# EAGLE design 4bit_CPU (EAGLE 7.1.0)
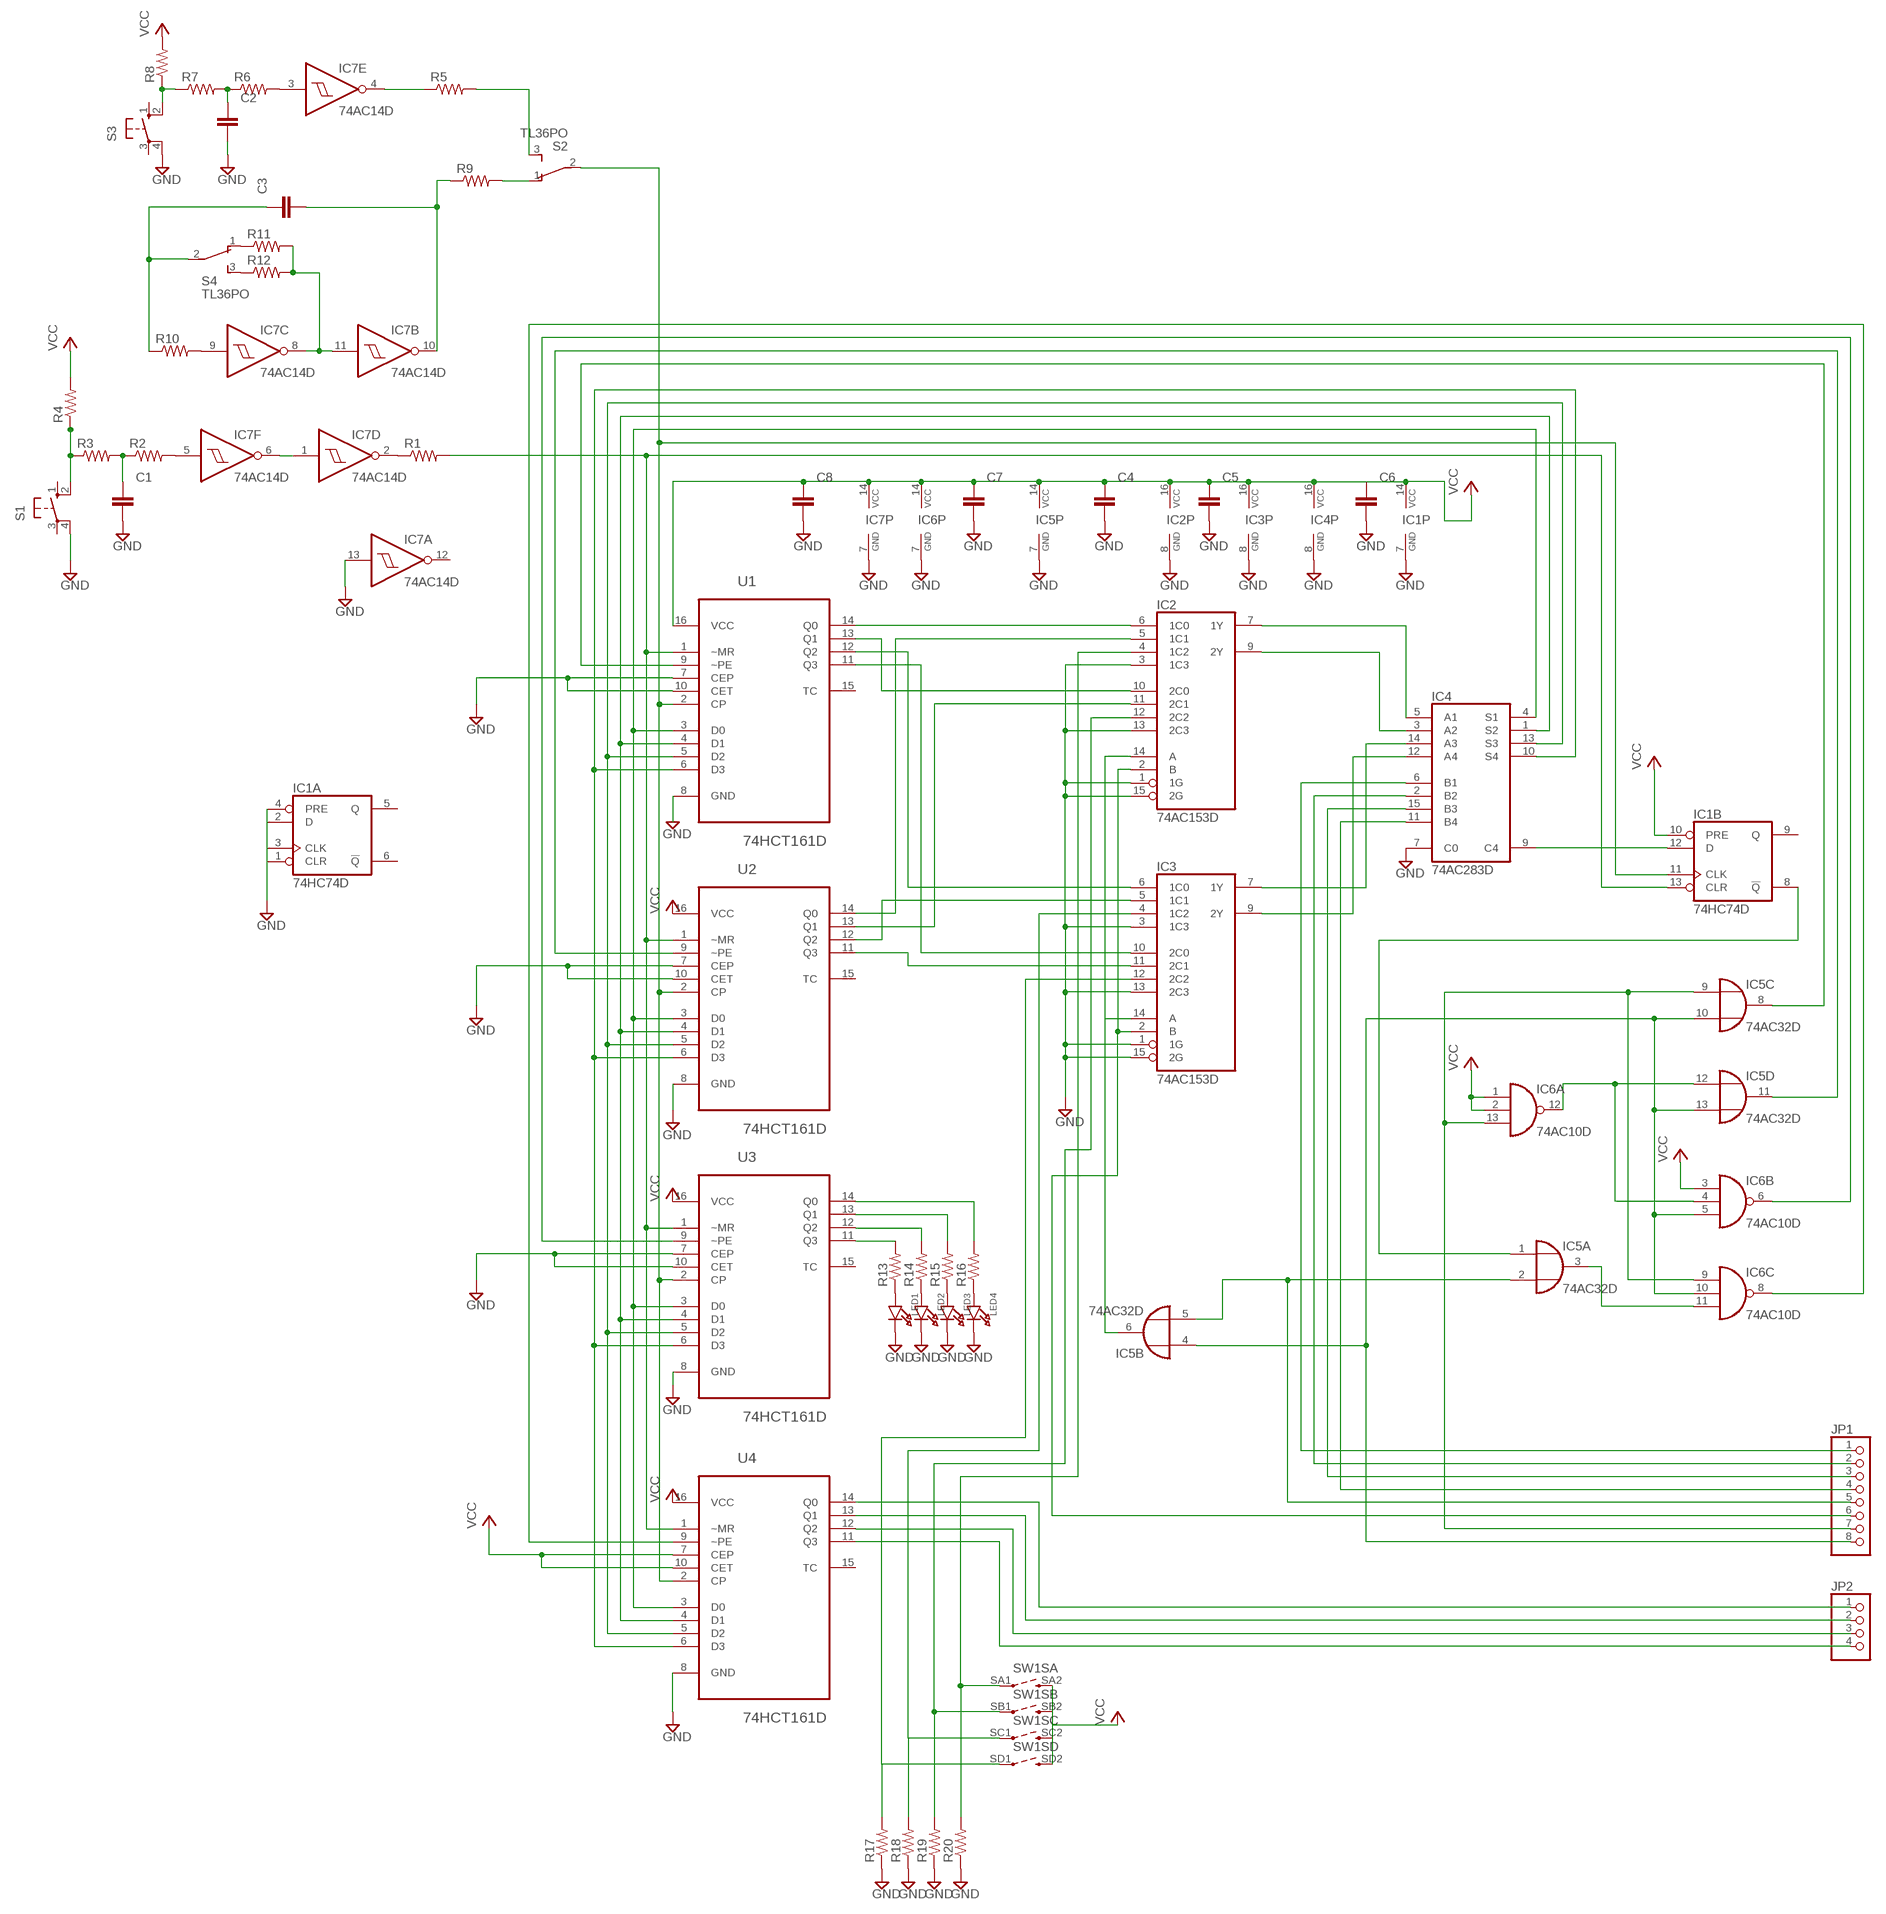
[diagram p0: schematic, sheet 1]

## Parts
C1  CAPACITOR_NPOL-0603  [C603]
C2  CAPACITOR_NPOL-0603  [C603]
C3  CAPACITOR_NPOL-0603  [C603]
C4  CAPACITOR_NPOL-0603  [C603]
C5  CAPACITOR_NPOL-0603  [C603]
C6  CAPACITOR_NPOL-0603  [C603]
C7  CAPACITOR_NPOL-0603  [C603]
C8  CAPACITOR_NPOL-0603  [C603]
IC1  74HC74D  [SO14]
IC2  74AC153D  [SO16]
IC3  74AC153D  [SO16]
IC4  74AC283D  [SO16]
IC5  74AC32D  [SO14]
IC6  74AC10D  [SO14]
IC7  74AC14D  [SO14]
JP1  HEADER-1X8  [1X08_OVAL]
JP2  HEADER-1X4  [1X04_OVAL]
LED1  LED0603  [CHIPLED_0603]
LED2  LED0603  [CHIPLED_0603]
LED3  LED0603  [CHIPLED_0603]
LED4  LED0603  [CHIPLED_0603]
R1  R-US_R0603  [R0603]
R2  R-US_R0603  [R0603]
R3  R-US_R0603  [R0603]
R4  R-US_R0603  [R0603]
R5  R-US_R0603  [R0603]
R6  R-US_R0603  [R0603]
R7  R-US_R0603  [R0603]
R8  R-US_R0603  [R0603]
R9  R-US_R0603  [R0603]
R10  R-US_R0603  [R0603]
R11  R-US_R0603  [R0603]
R12  R-US_R0603  [R0603]
R13  R-US_R0603  [R0603]
R14  R-US_R0603  [R0603]
R15  R-US_R0603  [R0603]
R16  R-US_R0603  [R0603]
R17  R-US_R0603  [R0603]
R18  R-US_R0603  [R0603]
R19  R-US_R0603  [R0603]
R20  R-US_R0603  [R0603]
S1  10-XX  [B3F-10XX]
S2  TL36PO  [TL3XPO]
S3  10-XX  [B3F-10XX]
S4  TL36PO  [TL3XPO]
SW1  SW_DIP_4P  [SW-SMT-4]
U1  74HCT161D  [SOIC127P600X175-16N]
U2  74HCT161D  [SOIC127P600X175-16N]
U3  74HCT161D  [SOIC127P600X175-16N]
U4  74HCT161D  [SOIC127P600X175-16N]

## Nets
GND: C1.2 C2.2 C4.2 C5.2 C6.2 C7.2 C8.2 IC1.1(A:CLR) IC1.2(A:D) IC1.3(A:CLK) IC1.4(A:PRE) IC1.7(P:GND) IC2.1(1G) IC2.3(1C3) IC2.8(GND) IC2.13(2C3) IC2.15(2G) IC3.1(1G) IC3.3(1C3) IC3.8(GND) IC3.13(2C3) IC3.15(2G) IC4.7(C0) IC4.8(GND) IC5.7(P:GND) IC6.7(P:GND) IC7.7(P:GND) IC7.13(A:I) LED1.C LED2.C LED3.C LED4.C R17.1 R18.1 R19.1 R20.1 S1.4(P1) S3.4(P1) U1.7(CEP) U1.10(CET) U2.7(CEP) U2.8(GND) U2.10(CET) U3.7(CEP) U3.8(GND) U3.10(CET) U4.8(GND)
N$1: IC2.14(A) IC3.14(A) IC5.6(B:O)
N$2: IC2.2(B) IC3.2(B) JP1.6
N$3: IC2.6(1C0) U1.14(Q0)
N$4: IC2.5(1C1) U2.14(Q0)
N$5: IC2.10(2C0) U1.13(Q1)
N$6: IC3.6(1C0) U1.12(Q2)
N$7: IC3.5(1C1) U2.12(Q2)
N$8: IC3.10(2C0) U1.11(Q3)
N$9: IC3.11(2C1) U2.11(Q3)
N$10: IC2.11(2C1) U2.13(Q1)
N$11: IC2.7(1Y) IC4.5(A1)
N$12: IC2.9(2Y) IC4.3(A2)
N$13: IC3.7(1Y) IC4.14(A3)
N$14: IC3.9(2Y) IC4.12(A4)
N$15: JP2.1 U4.14(Q0)
N$16: U1.8(GND)
N$17: IC1.11(B:CLK) S2.2(P) U1.2(CP) U2.2(CP) U3.2(CP) U4.2(CP)
N$18: IC1.12(B:D) IC4.9(C4)
N$19: IC1.13(B:CLR) R1.2 U1.1(~MR) U2.1(~MR) U3.1(~MR) U4.1(~MR)
N$20: IC4.4(S1) U1.3(D0) U2.3(D0) U3.3(D0) U4.3(D0)
N$21: IC4.1(S2) U1.4(D1) U2.4(D1) U3.4(D1) U4.4(D1)
N$22: IC4.13(S3) U1.5(D2) U2.5(D2) U3.5(D2) U4.5(D2)
N$23: IC4.10(S4) U1.6(D3) U2.6(D3) U3.6(D3) U4.6(D3)
N$24: IC5.9(C:I0) IC6.9(C:I0) IC6.13(A:I2) JP1.7
N$25: IC5.4(B:I0) IC5.10(C:I1) IC5.13(D:I1) IC6.5(B:I2) IC6.10(C:I1) JP1.8
N$26: IC5.12(D:I0) IC6.4(B:I1) IC6.12(A:O)
N$27: IC5.3(A:O) IC6.11(C:I2)
N$28: IC1.8(B:!Q) IC5.1(A:I0)
N$29: IC5.2(A:I1) IC5.5(B:I1) JP1.5
N$30: R5.2 S2.3(S)
N$31: IC5.8(C:O) U1.9(~PE)
N$32: IC5.11(D:O) U2.9(~PE)
N$33: IC6.6(B:O) U3.9(~PE)
N$34: IC6.8(C:O) U4.9(~PE)
N$35: IC7.2(D:O) R1.1
N$36: IC7.1(D:I) IC7.6(F:O)
N$37: IC7.5(F:I) R2.2
N$38: C1.1 R2.1 R3.2
N$39: R3.1 R4.1 S1.2(S1)
N$40: IC7.4(E:O) R5.1
N$41: IC7.3(E:I) R6.2
N$42: C2.1 R6.1 R7.2
N$43: R7.1 R8.1 S3.2(S1)
N$44: R9.2 S2.1(O)
N$45: IC7.8(C:O) IC7.11(B:I) R11.2 R12.2
N$46: C3.2 IC7.10(B:O) R9.1
N$47: IC7.9(C:I) R10.2
N$48: JP2.2 U4.13(Q1)
N$49: R11.1 S4.1(O)
N$50: R12.1 S4.3(S)
N$51: C3.1 R10.1 S4.2(P)
N$52: IC4.11(B4) JP1.4
N$53: IC4.15(B3) JP1.3
N$54: IC4.2(B2) JP1.2
N$55: IC4.6(B1) JP1.1
N$56: JP2.3 U4.12(Q2)
N$57: JP2.4 U4.11(Q3)
N$58: R13.2 U3.11(Q3)
N$59: R14.2 U3.12(Q2)
N$60: R15.2 U3.13(Q1)
N$61: R16.2 U3.14(Q0)
N$62: LED1.A R13.1
N$63: LED2.A R14.1
N$64: LED3.A R15.1
N$65: LED4.A R16.1
N$67: IC2.4(1C2) R20.2 SW1.SA1
N$68: IC2.12(2C2) R19.2 SW1.SB1
N$69: IC3.4(1C2) R18.2 SW1.SC1
N$70: IC3.12(2C2) R17.2 SW1.SD1
VCC: C4.1 C5.1 C6.1 C7.1 C8.1 IC1.10(B:PRE) IC1.14(P:VCC) IC2.16(VCC) IC3.16(VCC) IC4.16(VCC) IC5.14(P:VCC) IC6.1(A:I0) IC6.2(A:I1) IC6.3(B:I0) IC6.14(P:VCC) IC7.14(P:VCC) R4.2 R8.2 SW1.SA2 SW1.SB2 SW1.SC2 SW1.SD2 U1.16(VCC) U2.16(VCC) U3.16(VCC) U4.7(CEP) U4.10(CET) U4.16(VCC)
Unconnected: IC1.5(A:Q) IC1.6(A:!Q) IC1.9(B:Q) IC7.12(A:O) S1.1(S) S1.3(P) S3.1(S) S3.3(P) U1.15(TC) U2.15(TC) U3.15(TC) U4.15(TC)

## Library data of the parts
C1-C8 = dp_devices:CAPACITOR_NPOL: Non-Polarized capacitor in various packages
IC1 = 74xx-eu:74*74: Dual D type positive edge triggered FLIP FLOP, preset and clear
IC2 IC3 = 74xx-eu:74*153: Dual 4-line to 1-line data SELECTOR/MULTIPLEXER
IC4 = 74xx-eu:74*283: 4-bit binary FULL ADDER, fast carry
IC5 = 74xx-eu:74*32: Quad 2-input OR gate
IC6 = 74xx-eu:74*10: Triple 3-input NAND gate
IC7 = 74xx-eu:74*14: Hex schmitt trigger INVERTER
JP1 = OLED_mod:HEADER-1X8: PIN HEADER
JP2 = OLED_mod:HEADER-1X4: PIN HEADER
LED1-LED4 = OLED_mod:LED: LED 0603 - 0603 Surface Mount Package 2mA: Green LED - Low Power (3.9mcd, 2ma, 1.7Vf) - Digikey: 475-2709-2-ND Orange LED - Low Power (9.8mcd, 2ma, 1.8Vf) - Digikey: 475-1194-2-ND Red LED - Low Power (5mcd, 2ma, 1.8Vf) - Digikey: 475-1195-2-ND Yellow LED - Low Power (7mcd, 2ma, 1.8Vf) - Digikey: 475-1196-2-ND 5mA: Blue LED - Low Power (17mcd, 5ma, 2.9Vf) - Digikey: LNJ937W8CRACT-ND 0805 - 0805 Surface Mount Package 2mA: Red LED (8.8mcd, 2mA, 1.8Vf, Clear) - Low Power [Digikey: 475-2510-1-ND] Green LED (5mcd, 2mA, 1.8Vf, Clear) - Low Power [Digikey: 475-2730-1-ND] Yellow LED (11.3mcd, 2mA, 1.8Vf, Clear) - Low Power [Digikey: 475-2555-1-ND] 20mA: Red LED (104mcd, 20mA, Diffused) - LS R976 [Digikey: 475-1278-6-ND] Red LED (12mcd, 20mA, 2.0Vf, Clear) - APT2012EC [Digikey: 754-1128-1-ND] Green LED (15mcd, 20mA, 2.2Vf, Clear) - APT2012GC [Digikey: 754-1131-1-ND] Orange LED (160mcd, 20mA, 2.1Vf, Clear) - APT2012SECK [Digikey: 754-1130-1-ND] 1206 - 1206 Surface Mount Package Green LED (26mcd, 20mA, Diffused) - LG N971 [Digikey: 475-1407-6-ND] Red LED (15mcd, 20mA, Diffused) - LH N974 [Digikey: 475-1416-6-ND]
R1-R20 = rcl:R-US_: RESISTOR, American symbol
S1 S3 = switch-omron:10-XX: OMRON SWITCH; MPN: B3F-1000; OC_FARNELL: 176432; OC_NEWARK: 36M3542
S2 S4 = switch:TL36PO: TINY SWITCH ON - ON Source: http://www2.produktinfo.conrad.com/datenblaetter/700000-724999/705152-da-01-de-Subminiaturschalter_TL_36YO.pdf
SW1 = dp_devices:SW_DIP_4P
U1-U4 = NXP_By_element14_Batch_1:74HCT161D: Presettable synchronous 4-bit binary counter; MPN: 74HCT161D; OC_FARNELL: 1085312; OC_NEWARK: 99K0551; PACKAGE: SOIC-16; SUPPLIER: NXP

## Board
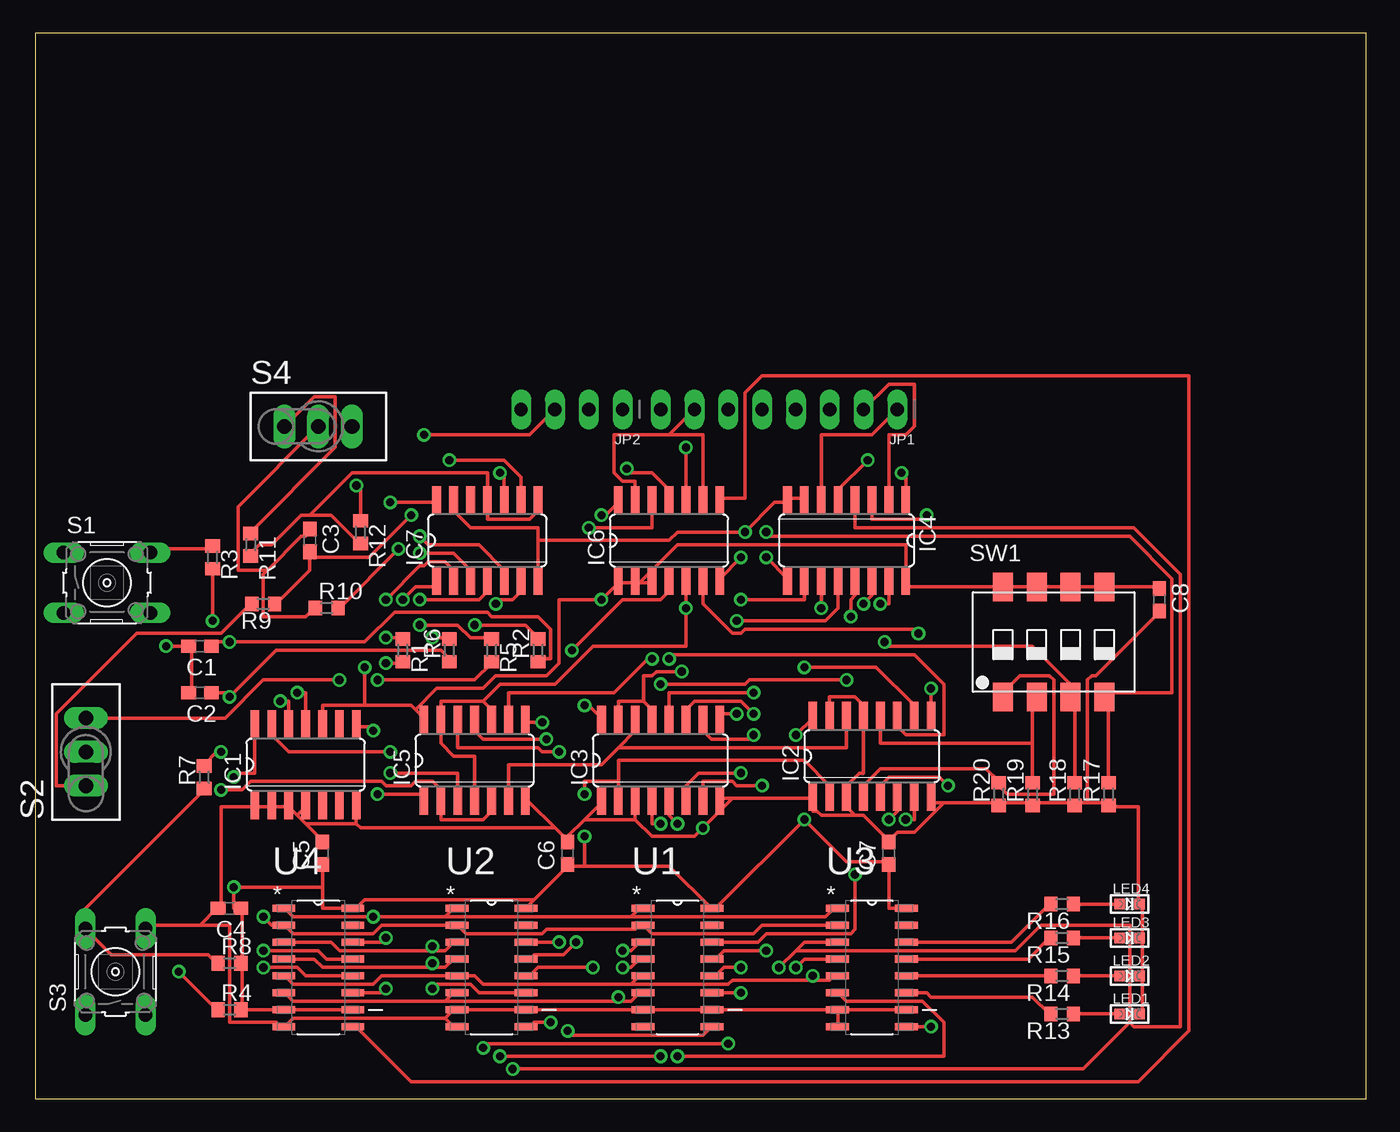
[diagram p1: board, top side]
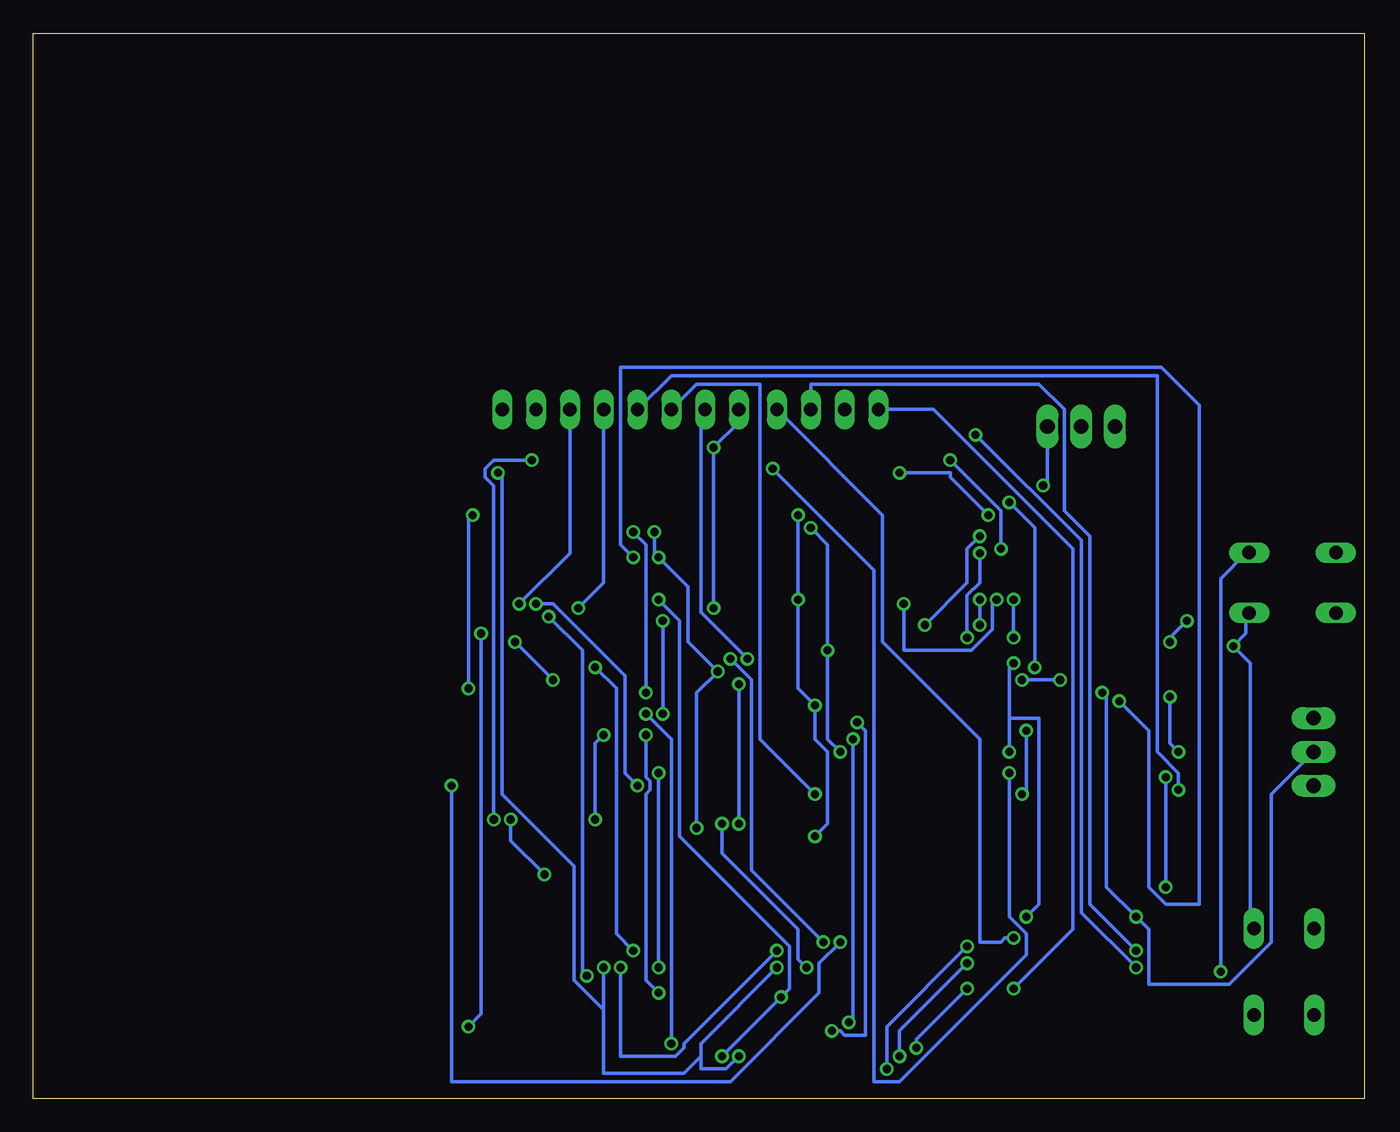
[diagram p2: board, bottom side, seen from below]

Size 100 x 80 mm. Coordinates in mm from the lower left corner, seen from the top.
Outline: 0,0 100,0 100,80 0,80 0,0
Copper layers (1*16): Top 0.035mm / dielectric 1.5mm / Bottom 0.035mm
Design rules "default": minimum track width 10mil, minimum drill 24mil, track to track 8mil, track to pad 8mil, pad to pad 8mil, via to via 8mil, smd to smd 8mil, copper to edge 40mil, drill to drill 8mil, minimum pad ring 10mil, minimum via ring 8mil, stop-mask expansion 4mil, vias tented up to drill 0mil, thermal gap 10mil
vRestrict: area 29.5,40 to 38.4,43.8; area 43.2,40 to 52.1,43.5; area 55.6,40 to 66.4,43.8; area 15.6,23.2 to 24.8,27.3; area 28.3,23.5 to 37.8,27.6; area 41.3,23.5 to 52.4,27.3; area 57.8,23.8 to 67.9,27.6; area 60.6,4.8 to 65.1,15.2; area 46.4,4.8 to 50.5,14.9; area 32.4,4.4 to 36.2,15.2; area 19.4,4.8 to 23.2,15.2; area 70.5,30.8 to 82.5,37.8

### Footprints (pad centres in the part's own frame; a part is rotated, then mirrored left to right if it is on the bottom)
C603 = smd 1.1 x 1: 1 -0.85,0; 2 0.85,0
SO14 = smd 0.66 x 2.032: 1 -3.81,-3.073; 2 -2.54,-3.073; 3 -1.27,-3.073; 4 0,-3.073; 5 1.27,-3.073; 6 2.54,-3.073; 7 3.81,-3.073; 8 3.81,3.073; 9 2.54,3.073; 10 1.27,3.073; 11 0,3.073; 12 -1.27,3.073; 13 -2.54,3.073; 14 -3.81,3.073
SO16 = smd 0.66 x 2.032: 1 -4.445,-3.073; 2 -3.175,-3.073; 3 -1.905,-3.073; 4 -0.635,-3.073; 5 0.635,-3.073; 6 1.905,-3.073; 7 3.175,-3.073; 8 4.445,-3.073; 9 4.445,3.073; 10 3.175,3.073; 11 1.905,3.073; 12 0.635,3.073; 13 -0.635,3.073; 14 -1.905,3.073; 15 -3.175,3.073; 16 -4.445,3.073
1X08_OVAL = drill 1 long: 1 -8.89,0; 2 -6.35,0; 3 -3.81,0; 4 -1.27,0; 5 1.27,0; 6 3.81,0; 7 6.35,0; 8 8.89,0
1X04_OVAL = drill 1 long: 1 -3.81,0; 2 -1.27,0; 3 1.27,0; 4 3.81,0
CHIPLED_0603 = smd 0.8 x 0.8: A 0,-0.75; C 0,0.75
R0603 = smd 1 x 1.1: 1 -0.85,0; 2 0.85,0
B3F-10XX = drill 1.016 long: 1 -3.251,2.261; 2 3.251,2.261; 3 -3.251,-2.261; 4 3.251,-2.261
TL3XPO = drill 1.1 pad 1.422 long: 1 -2.54,0; 2 0,0; 3 2.54,0
SW-SMT-4 = smd 1.5 x 2.15: SA1 -3.81,-4.125; SA2 -3.81,4.125; SB1 -1.27,-4.125; SB2 -1.27,4.125; SC1 1.27,-4.125; SC2 1.27,4.125; SD1 3.81,-4.125; SD2 3.81,4.125
SOIC127P600X175-16N = smd 1.702 x 0.533: 1 -2.591,4.445; 2 -2.591,3.175; 3 -2.591,1.905; 4 -2.591,0.635; 5 -2.591,-0.635; 6 -2.591,-1.905; 7 -2.591,-3.175; 8 -2.591,-4.445; 9 2.591,-4.445; 10 2.591,-3.175; 11 2.591,-1.905; 12 2.591,-0.635; 13 2.591,0.635; 14 2.591,1.905; 15 2.591,3.175; 16 2.591,4.445

### Placement (x,y rotation side)
C1  12.38,33.97 180 top
C2  12.38,30.48 180 top
C3  20.64,41.91 270 top
C4  14.61,14.29 180 top
C5  21.59,18.41 90 top
C6  40.01,18.41 90 top
C7  64.14,18.41 90 top
C8  84.45,37.47 270 top
IC1  20.32,25.08 0 top
IC2  62.87,25.72 0 top
IC3  46.99,25.4 0 top
IC4  60.96,41.91 180 top
IC5  33.02,25.4 0 top
IC6  47.62,41.91 0 top
IC7  33.97,41.91 0 top
JP1  55.88,51.75 180 top
JP2  40.32,51.75 180 top
LED1  82.23,6.35 270 top
LED2  82.23,9.21 270 top
LED3  82.23,12.06 270 top
LED4  82.23,14.61 270 top
R1  27.62,33.66 270 top
R2  37.78,33.66 90 top
R3  13.34,40.64 270 top
R4  14.61,6.67 0 top
R5  34.29,33.66 270 top
R6  31.11,33.66 90 top
R7  12.7,24.13 90 top
R8  14.61,10.16 0 top
R9  17.14,37.15 180 top
R10  21.91,36.83 0 top
R11  16.19,41.59 270 top
R12  24.45,42.55 270 top
R13  77.15,6.35 180 top
R14  77.15,9.21 180 top
R15  77.15,12.06 180 top
R16  77.15,14.61 180 top
R17  80.64,22.86 90 top
R18  78.11,22.86 90 top
R19  74.93,22.86 90 top
R20  72.39,22.86 90 top
S1  5.4,38.73 0 top
S2  3.81,26.04 90 top
S3  6.03,9.53 90 top
S4  21.27,50.48 0 top
SW1  76.52,34.29 0 top
U1  48.26,9.84 0 top
U2  34.29,9.84 0 top
U3  62.87,9.84 0 top
U4  21.27,9.84 0 top

### Tracks (layer width: path | path; a pad name or v marks a point on that pad's centre or on a via)
GND  (via drill 0.61)
  Top 0.254: 60.33,6.67 60.33,5.4 U3.8 | 60.33,6.67 U3.10 | 60.33,6.67 U3.7 U1.10 U1.7 U2.10 U2.7 31.43,6.67 30.8,6.03 | 30.8,6.03 19.37,6.03 18.73,5.4 U4.8 18.41,5.4 18.1,5.71 14.61,5.71 14.61,13.02 12.38,13.02 | 30.8,6.03 31.43,5.4 U2.8 | 37.78,41.91 37.78,42.86 32.7,42.86 31.43,44.13 IC7.13 | 37.78,41.91 IC7.7 | IC3.15 43.81,29.84 45.72,29.84 | 45.72,29.84 46.35,29.21 IC3.13 | v53.02,40.64 51.44,39.05 IC6.7 | IC4.7 57.78,45.09 56.52,45.09 IC4.8 56.52,44.77 55.56,44.77 v53.34,42.55 48.26,42.55 47.62,41.91 37.78,41.91 | 45.72,29.84 45.72,31.75 46.35,31.75 46.67,32.07 v48.58,32.07 | C2.2 11.75,30.48 11.75,33.97 C1.2 v9.84,33.97 | 12.38,13.02 13.65,14.29 C4.2 13.97,14.29 13.97,21.91 16.51,21.91 | 12.38,13.02 8.57,13.02 S3.4 | 17.78,21.91 16.51,21.91 | 19.05,21.91 19.68,21.27 | 19.68,21.27 20.32,20.64 | 20.32,20.64 21.59,19.37 C5.2 | 19.68,21.27 20.32,21.91 IC1.4 | 24.13,20.64 IC1.7 | 20.32,20.64 24.13,20.64 | 19.05,21.91 17.78,21.91 | 17.78,21.91 IC1.2 | 19.05,21.91 IC1.3 | 16.51,21.91 IC1.1 | 39.05,20.32 37.15,22.23 36.83,22.23 IC5.7 | 39.05,20.32 39.69,19.68 | 39.69,19.68 40.01,19.37 C6.2 39.69,19.68 | 41.27,20.95 40.01,19.68 39.69,19.68 | 41.27,20.95 42.55,22.23 IC3.1 | 45.09,20.95 IC3.3 | 41.27,20.95 45.09,20.95 | 58.42,22.54 52.39,22.54 | 52.39,22.54 51.44,22.54 IC3.8 | IC2.15 59.69,30.16 61.59,30.16 62.23,29.53 IC2.13 62.23,24.45 61.91,24.45 60.96,23.5 IC2.3 60.96,21.91 61.59,21.27 | 64.14,19.37 62.23,21.27 61.59,21.27 | 58.42,22.54 58.42,21.59 58.74,21.59 59.05,21.27 61.59,21.27 | 58.42,22.54 IC2.1 | 45.09,20.95 46.35,19.68 49.53,19.68 v50.16,20.32 52.39,22.54 | 83.19,12.06 83.19,14.61 LED4.C 82.87,14.61 82.87,21.91 80.64,21.91 R17.1 80.64,22.23 79.06,22.23
  Top 0.254: 83.19,9.21 83.19,6.35 LED1.C | 83.19,9.21 83.19,12.06 | 83.19,12.06 LED3.C | 83.19,9.21 LED2.C | 74.93,22.23 72.39,22.23 | 79.06,22.23 78.11,22.23 | 79.06,22.23 79.06,31.43 79.38,31.75 79.69,31.75 84.45,36.51 C8.2 | 78.11,22.23 74.93,22.23 | 74.93,22.23 R19.1 | 78.11,22.23 R18.1 | 72.39,22.23 68.26,22.23 | 68.26,22.23 67.63,22.23 67.31,22.54 IC2.8 | 72.39,22.23 R20.1 | 64.14,19.37 64.77,20 66.04,20 68.26,22.23 | 64.14,19.37 C7.2 | 24.13,20.64 24.45,20.32 39.05,20.32
  Bottom 0.254: v53.34,42.55 53.34,40.96 v53.02,40.64 50.8,38.42 50.8,34.29 v48.58,32.07 50.16,30.48 v50.16,20.32 | S1.4 8.89,36.2 8.89,34.92 v9.84,33.97 8.57,32.7 8.57,13.02 S3.4
N$1
  Top 0.254: IC5.6 35.56,25.08 42.55,25.08 43.81,26.35 | 43.81,26.35 45.09,27.62 IC3.14 | IC2.14 60.96,26.35 43.81,26.35
N$2  (via drill 0.61)
  Top 0.254: 43.81,23.81 43.81,25.4 57.78,25.4 59.69,23.5 IC2.2 | 43.81,23.81 IC3.2 | v41.27,22.86 41.27,23.81 43.81,23.81
  Bottom 0.254: JP1.6 50.16,53.66 45.4,53.66 45.4,26.99 v41.27,22.86
N$3  (via drill 0.61)
  Top 0.254: U1.14 54.29,11.75 54.93,12.38 61.28,12.38 61.59,12.7 v61.59,16.83 | v64.14,20.95 64.77,21.59 IC2.6
  Bottom 0.254: v61.59,16.83 64.14,19.37 v64.14,20.95
N$4  (via drill 0.61)
  Top 0.254: v39.37,11.75 U2.14 | v68.58,23.5 67.94,24.13 64.14,24.13 63.5,23.5 IC2.5
  Bottom 0.254: v39.37,11.75 40.96,10.16 40.96,7.94 47.62,1.27 68.58,1.27 v68.58,23.5
N$5  (via drill 0.61)
  Top 0.254: v54.93,11.11 51.75,11.11 51.12,10.48 U1.13 | v57.78,32.38 63.18,32.38 66.04,29.53 IC2.10
  Bottom 0.254: v54.93,11.11 56.2,12.38 56.2,30.8 v57.78,32.38
N$6  (via drill 0.61)
  Top 0.254: v53.02,9.84 51.75,9.84 51.12,9.21 U1.12 | v53.02,24.45 49.85,24.45 48.9,23.5 IC3.6
  Bottom 0.254: v53.02,24.45 v53.02,9.84
N$7  (via drill 0.61)
  Top 0.254: v41.91,9.84 37.78,9.84 37.15,9.21 U2.12 | v48.26,20.64 47.62,21.27 IC3.5
  Bottom 0.254: v41.91,9.84 42.55,10.48 42.55,12.7 48.26,18.41 v48.26,20.64
N$8  (via drill 0.61)
  Top 0.254: v53.02,7.94 U1.11 | v53.98,27.3 53.66,26.99 50.8,26.99 50.16,27.62 IC3.10
  Bottom 0.254: v53.02,7.94 53.98,8.89 53.98,22.86 53.66,23.18 53.66,23.81 53.98,24.13 v53.98,27.3
N$9  (via drill 0.61)
  Top 0.254: U2.11 33.34,7.94 32.7,8.57 30.16,8.57 v29.84,8.26 | v33.66,3.81 33.97,4.13 v52.07,4.13 | v53.98,28.89 53.02,29.84 49.53,29.84 48.9,29.21 IC3.11
  Bottom 0.254: v29.84,8.26 33.66,4.45 v33.66,3.81 | v52.07,4.13 52.07,26.99 v53.98,28.89
N$10  (via drill 0.61)
  Top 0.254: v40.64,11.75 39.69,10.79 37.47,10.79 37.15,10.48 U2.13 | v47.62,33.02 47.94,33.34 66.04,33.34 68.26,31.11 68.26,27.3 65.41,27.3 64.77,27.94 IC2.11
  Bottom 0.254: v40.64,11.75 46.04,17.14 46.04,31.43 v47.62,33.02
N$11  (via drill 0.61)
  Top 0.254: IC2.7 66.04,20.95 v65.41,20.95 | v62.55,47.94 60.33,45.72 IC4.5
  Bottom 0.254: v65.41,20.95 65.41,46.04 66.04,46.67 66.04,47.31 65.41,47.94 v62.55,47.94
N$12  (via drill 0.61)
  Top 0.254: IC4.3 62.87,43.5 66.67,43.5 v66.99,43.81 | IC2.9 v67.31,30.8
  Bottom 0.254: v66.99,43.81 67.31,43.5 v67.31,30.8
N$13  (via drill 0.61)
  Top 0.254: IC3.7 50.16,23.81 52.39,23.81 52.7,23.5 v54.61,23.5 | v62.23,37.15 62.87,37.78 IC4.14
  Bottom 0.254: v54.61,23.5 55.56,24.45 55.56,31.75 60.96,37.15 v62.23,37.15
N$14  (via drill 0.61)
  Top 0.254: v52.7,28.89 51.75,28.89 51.44,28.57 IC3.9 | v52.7,35.88 59.37,35.88 60.33,36.83 IC4.12
  Bottom 0.254: v52.7,35.88 v52.7,28.89
N$15  (via drill 0.61)
  Top 0.254: U4.14 26.04,11.75 v26.35,12.06
  Bottom 0.254: v26.35,12.06 26.99,12.06 27.3,11.75 28.89,11.75 28.89,26.99 36.2,34.29 36.2,43.81 JP2.1
N$17  (via drill 0.61)
  Top 0.254: U3.2 54.61,13.02 53.98,12.38 46.35,12.38 45.72,13.02 U1.2 45.4,13.02 45.09,12.7 38.42,12.7 38.1,12.38 32.38,12.38 31.75,13.02 U2.2 26.04,13.02 25.4,12.38 19.37,12.38 18.73,13.02 U4.2 17.78,13.02 v17.14,13.65 | IC1.11 20.32,30.48 v19.68,30.48
  Bottom 0.254: v19.68,30.48 19.37,30.16 19.37,15.88 v17.14,13.65 16.19,12.7 16.19,8.57 10.16,8.57 6.99,11.75 6.99,22.86 S2.2
N$18  (via drill 0.61)
  Top 0.254: IC1.12 19.05,29.84 v18.41,29.84 | v54.93,40.64 56.52,39.05 IC4.9
  Bottom 0.254: v18.41,29.84 16.19,27.62 16.19,15.88 14.92,14.61 12.38,14.61 12.38,52.07 15.24,54.93 55.88,54.93 55.88,41.59 v54.93,40.64
N$19  (via drill 0.61)
  Top 0.254: v26.35,32.7 27.62,32.7 R1.2 | v26.67,26.04 19.05,26.04 17.78,27.3 IC1.13 | 30.8,13.65 v25.4,13.65 19.37,13.65 18.73,14.29 U4.1 | 30.8,13.65 31.43,14.29 U2.1 | 44.77,13.65 45.4,14.29 U1.1 | 30.8,13.65 44.77,13.65 | 44.77,13.65 59.37,13.65 60.01,14.29 U3.1
  Bottom 0.254: v26.35,32.7 26.67,32.38 26.67,28.57 | v26.67,26.04 26.67,28.57 | 26.67,28.57 24.45,28.57 24.45,14.61 v25.4,13.65
N$20  (via drill 0.61)
  Top 0.254: U4.3 22.23,11.75 22.86,11.11 29.84,11.11 | 29.84,11.11 30.8,11.11 31.43,11.75 U2.3 | v44.13,11.11 44.77,11.11 45.4,11.75 U1.3 | 57.15,11.11 57.78,11.75 U3.3 | 57.15,11.11 v55.88,9.84 | IC4.4 61.59,42.86 82.55,42.86 86.04,39.37 86.04,5.4 82.55,5.4 82.23,5.71 | 82.23,5.71 82.23,13.02 75.56,13.02 73.66,11.11 57.15,11.11 | v29.84,11.43 29.84,11.11 | v35.88,2.22 78.74,2.22 82.23,5.71
  Bottom 0.254: v44.13,11.11 51.12,4.13 51.12,3.81 51.75,3.17 55.88,3.17 v55.88,9.84 | v29.84,11.43 35.88,5.4 v35.88,2.22
N$21  (via drill 0.61)
  Top 0.254: U4.4 20.95,10.48 21.59,9.84 29.84,9.84 | 29.84,9.84 30.8,9.84 31.43,10.48 U2.4 | v44.13,9.84 44.77,9.84 45.4,10.48 U1.4 | v57.15,9.84 57.78,10.48 U3.4 | IC4.1 65.41,46.99 v65.09,46.99 | v29.84,10.16 29.84,9.84 | v46.99,3.17 v34.92,3.17
  Bottom 0.254: v44.13,9.84 49.85,4.13 49.85,3.17 | 49.85,3.17 51.12,1.91 57.15,1.91 57.15,6.67 | v57.15,9.84 57.15,6.67 | v65.09,46.99 64.77,46.67 64.77,22.86 59.37,17.46 59.37,8.89 57.15,6.67 | v29.84,10.16 34.92,5.08 v34.92,3.17 | v46.99,3.17 47.94,2.22 49.85,2.22 49.85,3.17
N$22  (via drill 0.61)
  Top 0.254: U4.5 18.73,9.21 19.37,8.57 25.4,8.57 26.04,9.21 U2.5 33.02,9.21 33.66,8.57 44.77,8.57 | 44.77,8.57 45.4,9.21 U1.5 | 58.42,8.89 52.39,8.89 52.07,8.57 44.77,8.57 | 58.42,8.89 59.69,8.89 60.01,9.21 U3.5 | IC4.13 61.59,37.78 61.28,37.47 v61.28,36.2 | 58.42,8.89 v58.42,9.21
  Bottom 0.254: v61.28,36.2 58.74,33.66 58.74,9.53 v58.42,9.21
N$23  (via drill 0.61)
  Top 0.254: 30.8,7.3 19.37,7.3 18.73,7.94 U4.6 | 30.8,7.3 31.43,7.94 U2.6 | 30.8,7.3 43.81,7.3 | 43.81,7.3 44.77,7.3 45.4,7.94 U1.6 | v48.26,3.17 68.26,3.17 68.26,5.71 66.67,7.3 60.96,7.3 60.33,7.94 U3.6 | 43.81,7.3 v43.81,7.62 | IC4.10 57.78,37.47 v53.02,37.47
  Bottom 0.254: v48.26,3.17 v43.81,7.62 43.18,8.26 43.18,11.43 51.44,19.68 51.44,35.88 v53.02,37.47
N$24  (via drill 0.61)
  Top 0.254: IC5.9 35.56,30.48 43.5,30.48 46.04,33.02 v46.35,33.02 | IC6.13 45.09,46.35 44.13,46.35 43.5,46.99 43.5,49.85 47.62,49.85 | JP1.7 47.62,49.85 | IC6.9 50.16,49.85 47.62,49.85
  Bottom 0.254: v46.35,33.02 49.85,36.51 49.85,51.44 JP1.7
N$25  (via drill 0.61)
  Top 0.254: v48.9,48.9 IC6.10 | 33.66,29.84 30.48,29.84 IC5.13 30.48,26.67 31.43,25.72 33.02,25.72 IC5.4 | 33.66,29.84 34.29,29.21 IC5.10 | IC6.5 v48.9,36.83 48.9,33.97 41.91,33.97 39.05,31.11 34.92,31.11 33.66,29.84
  Bottom 0.254: JP1.8 46.99,50.8 v48.9,48.9 v48.9,36.83
N$26  (via drill 0.61)
  Top 0.254: IC5.12 31.75,26.35 37.78,26.35 38.1,26.04 v39.37,26.04 | v40.32,33.66 44.13,37.47 46.99,37.47 47.62,38.1 IC6.4 | IC6.12 46.35,42.86 v41.59,42.86
  Bottom 0.254: v39.37,26.04 40.32,26.99 v40.32,33.66 40.32,41.59 v41.59,42.86
N$27  (via drill 0.61)
  Top 0.254: IC5.3 31.75,24.45 v26.67,24.45 | v44.45,47.31 44.77,46.99 46.35,46.99 47.62,45.72 IC6.11
  Bottom 0.254: v26.67,24.45 26.67,13.65 25.4,12.38 25.4,10.79 34.92,1.27 36.83,1.27 36.83,39.69 v44.45,47.31
N$28  (via drill 0.61)
  Top 0.254: v25.72,22.86 28.89,22.86 29.21,22.54 IC5.1 | v25.4,27.62 25.08,27.94 24.13,27.94 IC1.8
  Bottom 0.254: v25.72,22.86 25.4,23.18 v25.4,27.62
N$29  (via drill 0.61)
  Top 0.254: IC5.5 34.29,21.59 33.66,20.95 30.48,20.95 IC5.2 30.48,23.18 29.84,23.81 28.57,23.81 28.26,23.5 26.35,23.5 26.04,23.81 16.19,23.81 15.56,23.18 v13.97,23.18
  Bottom 0.254: JP1.5 52.07,54.29 15.56,54.29 15.56,26.04 13.97,24.45 v13.97,23.18
N$30  (via drill 0.61)
  Top 0.254: v25.72,31.43 33.02,31.43 34.29,32.7 R5.2 | v22.86,31.43 17.14,31.43 14.29,28.57 S2.3
  Bottom 0.254: v22.86,31.43 v25.72,31.43
N$31  (via drill 0.61)
  Top 0.254: v40.01,5.08 40.32,4.76 50.16,4.76 50.8,5.4 U1.9 | v38.1,28.26 36.83,28.26 IC5.8
  Bottom 0.254: v40.01,5.08 39.37,5.08 39.05,4.76 37.47,4.76 37.47,27.62 v38.1,28.26
N$32  (via drill 0.61)
  Top 0.254: v38.73,5.71 37.47,5.71 37.15,5.4 U2.9 | v38.42,26.99 33.66,26.99 33.02,27.62 IC5.11
  Bottom 0.254: v38.73,5.71 38.42,6.03 v38.42,26.99
N$33  (via drill 0.61)
  Top 0.254: v67.31,5.4 U3.9 | v66.36,34.92 66.04,35.24 53.34,35.24 53.02,34.92 52.39,34.92 50.16,37.15 IC6.6
  Bottom 0.254: v67.31,5.4 66.36,6.35 v66.36,34.92
N$34
  Top 0.254: U4.9 24.13,5.4 28.26,1.27 82.87,1.27 86.68,5.08 86.68,54.29 54.61,54.29 53.34,53.02 53.34,45.09 51.44,45.09 IC6.8
N$35  (via drill 0.61)
  Top 0.254: v26.35,34.61 27.62,34.61 R1.1 | v26.35,37.47 28.89,40.01 29.21,40.01 29.53,40.32 30.8,40.32 31.43,39.69 IC7.2
  Bottom 0.254: v26.35,37.47 v26.35,34.61
N$36  (via drill 0.61)
  Top 0.254: v27.62,37.47 28.57,38.42 29.84,38.42 30.16,38.73 IC7.1 | v34.61,37.15 34.92,37.47 35.88,37.47 36.51,38.1 IC7.6
  Bottom 0.254: v27.62,37.47 27.94,37.15 27.94,35.24 29.53,33.66 34.61,33.66 v34.61,37.15
N$37  (via drill 0.61)
  Top 0.254: v33.02,35.56 36.83,35.56 37.78,34.61 R2.2 | v28.89,42.23 29.53,41.59 33.34,41.59 35.24,39.69 IC7.5
  Bottom 0.254: v33.02,35.56 29.84,38.73 29.84,41.27 v28.89,42.23
N$38  (via drill 0.61)
  Top 0.254: C1.1 13.34,33.97 13.65,34.29 v14.61,34.29 24.77,34.29 26.99,36.51 33.97,36.51 34.29,36.2 37.78,36.2 38.73,35.24 38.73,33.02 37.78,33.02 R2.1 | v13.34,35.88 R3.2
  Bottom 0.254: v13.34,35.88 14.61,34.61 v14.61,34.29
N$39  (via drill 0.61)
  Top 0.254: R3.1 13.34,41.27 8.89,41.27 S1.2 | v10.79,9.53 13.65,6.67 R4.1
  Bottom 0.254: v10.79,9.53 10.79,39.05 8.89,40.96 S1.2
N$40  (via drill 0.61)
  Top 0.254: v28.89,35.56 31.75,35.56 32.7,34.61 34.29,34.61 R5.1 | v28.89,37.47 33.34,37.47 33.97,38.1 IC7.4
  Bottom 0.254: v28.89,37.47 v28.89,35.56
N$41  (via drill 0.61)
  Top 0.254: v29.84,34.61 31.11,34.61 R6.2 | v28.89,40.96 31.43,40.96 32.7,39.69 IC7.3
  Bottom 0.254: v29.84,34.61 29.84,37.78 28.89,38.73 v28.89,40.96
N$42  (via drill 0.61)
  Top 0.254: v13.97,26.04 13.65,26.04 12.7,25.08 R7.2 | C2.1 14.29,30.48 v14.61,30.16 18.1,33.66 30.48,33.66 31.11,33.02 R6.1
  Bottom 0.254: v13.97,26.04 14.61,26.67 v14.61,30.16
N$43
  Top 0.254: R8.1 13.65,10.16 13.02,10.79 5.71,10.79 3.81,12.7 S3.2 3.81,13.02 3.81,14.29 12.7,23.18 R7.1
N$44
  Top 0.254: S2.1 1.59,23.5 1.59,28.89 7.62,34.92 13.97,34.92 16.19,37.15 R9.2
N$45
  Top 0.254: IC7.8 37.78,44.13 37.15,43.5 33.97,43.5 IC7.11 33.97,46.99 23.81,46.99 20.64,43.81 | 20.64,43.81 22.23,43.81 24.13,41.91 24.45,41.91 R12.2 | 20.64,43.81 20,43.81 17.78,41.59 16.83,41.59 16.19,40.96 R11.2
N$46  (via drill 0.61)
  Top 0.254: 20.64,40.64 C3.2 20.64,40.96 | 20.64,40.64 20.64,39.69 18.1,37.15 R9.1 | IC7.10 35.24,46.99 v34.92,46.99 | v28.26,43.81 25.08,40.64 20.64,40.64
  Bottom 0.254: v34.92,46.99 31.11,46.99 31.11,46.67 v28.26,43.81
N$47  (via drill 0.61)
  Top 0.254: v27.3,41.27 22.86,36.83 R10.2 | v31.11,47.94 35.24,47.94 36.51,46.67 IC7.9
  Bottom 0.254: v27.3,41.27 27.3,44.13 v31.11,47.94
N$48  (via drill 0.61)
  Top 0.254: U4.13 21.91,10.48 21.27,11.11 v17.14,11.11
  Bottom 0.254: v17.14,11.11 20.64,14.61 20.64,42.23 22.54,44.13 22.54,51.75 24.45,53.66 41.59,53.66 JP2.2
N$49
  Top 0.254: S4.1 20.95,52.7 22.54,52.7 22.54,48.9 16.19,42.55 R11.1
N$50  (via drill 0.61)
  Top 0.254: R12.1 24.45,46.04 v24.13,46.04
  Bottom 0.254: v24.13,46.04 23.81,46.35 S4.3
N$51
  Top 0.254: 17.46,39.69 17.14,39.37 17.14,36.2 20.32,36.2 20.95,36.83 R10.1 | 17.46,39.69 20,42.23 20.32,42.23 20.64,42.55 C3.1 | S4.2 15.24,44.45 15.24,39.69 17.46,39.69
N$52  (via drill 0.61)
  Top 0.254: v59.05,36.83 IC4.11
  Bottom 0.254: v59.05,36.83 57.15,38.73 JP1.4
N$53  (via drill 0.61)
  Top 0.254: IC4.15 64.14,37.15 v63.5,37.15
  Bottom 0.254: v63.5,37.15 59.69,40.96 JP1.3
N$54
  Top 0.254: IC4.2 64.14,49.85 65.41,49.85 66.04,50.48 66.04,53.66 64.14,53.66 JP1.2
N$55
  Top 0.254: IC4.6 59.05,49.85 62.87,49.85 JP1.1
N$56  (via drill 0.61)
  Top 0.254: U4.12 20.32,9.21 19.68,9.84 v17.14,9.84 | v29.21,49.85 37.15,49.85 JP2.3
  Bottom 0.254: v17.14,9.84 21.27,13.97 21.27,41.91 v29.21,49.85
N$57  (via drill 0.61)
  Top 0.254: U4.11 26.04,7.94 v26.35,8.26
  Bottom 0.254: v26.35,8.26 21.91,12.7 21.91,41.27 32.38,51.75 JP2.4
N$58
  Top 0.254: U3.11 66.99,7.94 67.31,7.62 74.93,7.62 76.2,6.35 R13.2
N$59
  Top 0.254: U3.12 R14.2
N$60
  Top 0.254: U3.13 74.61,10.48 76.2,12.06 R15.2
N$61
  Top 0.254: U3.14 73.34,11.75 76.2,14.61 R16.2
N$62
  Top 0.254: R13.1 LED1.A
N$63
  Top 0.254: R14.1 LED2.A
N$64
  Top 0.254: R15.1 LED3.A
N$65
  Top 0.254: R16.1 LED4.A
N$67
  Top 0.254: IC2.4 62.23,23.5 63.5,24.77 71.44,24.77 72.39,23.81 R20.2 72.39,23.5 73.03,22.86 76.52,22.86 76.52,31.43 76.2,31.75 73.98,31.75 72.71,30.48 SW1.SA1
N$68
  Top 0.254: 74.93,26.67 74.93,30.16 SW1.SB1 | 74.93,26.67 R19.2 | IC2.12 63.5,26.67 74.93,26.67
N$69  (via drill 0.61)
  Top 0.254: R18.2 78.11,30.16 SW1.SC1 77.79,31.11 74.93,33.97 64.14,33.97 v63.82,34.29 | IC3.4 46.35,20.64 v46.99,20.64 | v46.99,31.11 53.34,31.11 53.66,31.43 v60.96,31.43
  Bottom 0.254: v46.99,31.11 v46.99,20.64 | v63.82,34.29 v60.96,31.43
N$70  (via drill 0.61)
  Top 0.254: R17.2 80.64,30.16 SW1.SD1 80.33,30.48 85.41,30.48 85.41,39.05 82.23,42.23 55.24,42.23 v54.93,42.55 | IC3.12 47.62,30.48 v53.98,30.48
  Bottom 0.254: v53.98,30.48 53.98,41.59 v54.93,42.55
VCC  (via drill 0.61)
  Top 0.254: 21.59,15.88 21.59,14.29 U4.16 24.13,14.29 24.77,14.92 37.47,14.92 | 21.59,15.88 C5.1 | 15.56,6.67 U4.7 U4.10 | 15.56,6.67 15.56,10.16 | 15.56,6.67 R4.2 | 15.56,10.16 15.56,14.29 C4.1 14.92,14.29 v14.92,15.88 21.59,15.88 | 15.56,10.16 R8.2 | IC1.14 16.51,24.45 15.24,24.45 v14.92,24.13 | 37.47,14.92 36.83,14.29 U2.16 | 37.47,14.92 40.01,17.46 | 40.01,17.46 41.27,17.46 | 41.27,17.46 47.62,17.46 50.8,14.29 U1.16 51.12,14.29 v57.78,20.95 60.96,17.78 64.14,17.78 C7.1 64.14,14.29 U3.16 | 40.01,17.46 C6.1 | v57.15,27.3 58.42,28.57 IC2.16 | IC1.10 21.59,29.53 24.77,29.53 | 24.77,29.53 28.26,29.53 28.57,29.21 | 28.57,29.21 29.21,28.57 IC5.14 | v26.67,44.77 30.16,44.77 IC7.14 | 24.77,29.53 v24.77,32.38 | SW1.SD2 84.45,38.42 C8.1 | SW1.SA2 65.72,38.42 65.41,38.73 IC4.16 65.41,41.59 48.26,41.59 45.4,38.73 | SW1.SA2 SW1.SB2 | SW1.SA2 | SW1.SB2 SW1.SC2 | SW1.SB2 | SW1.SC2 SW1.SD2 | SW1.SD2 | SW1.SC2 | v41.27,29.53 41.59,29.53 42.55,28.57 IC3.16 | 43.81,38.73 v42.55,37.47 39.37,37.47 39.37,32.7 38.42,31.75 34.61,31.75 33.66,30.8 30.16,30.8 28.57,29.21 | 43.81,38.73 45.09,38.73 | 43.81,38.73 IC6.1 | 45.09,38.73 45.4,38.73 | 45.4,38.73 46.35,38.73 IC6.3 | 45.09,38.73 IC6.2 45.4,38.73 | v42.55,43.81 42.86,43.81 43.81,44.77 IC6.14 | v41.27,19.68 41.27,17.46
  Bottom 0.254: v14.92,15.88 v14.92,24.13 | v57.15,27.3 57.78,26.67 v57.78,20.95 | v26.67,44.77 24.77,42.86 v24.77,32.38 | v42.55,43.81 v42.55,37.47 42.55,30.8 v41.27,29.53 41.27,26.99 40.32,26.04 40.32,20.64 v41.27,19.68